# Altium schematic sheet stm8.SchDoc
size A3
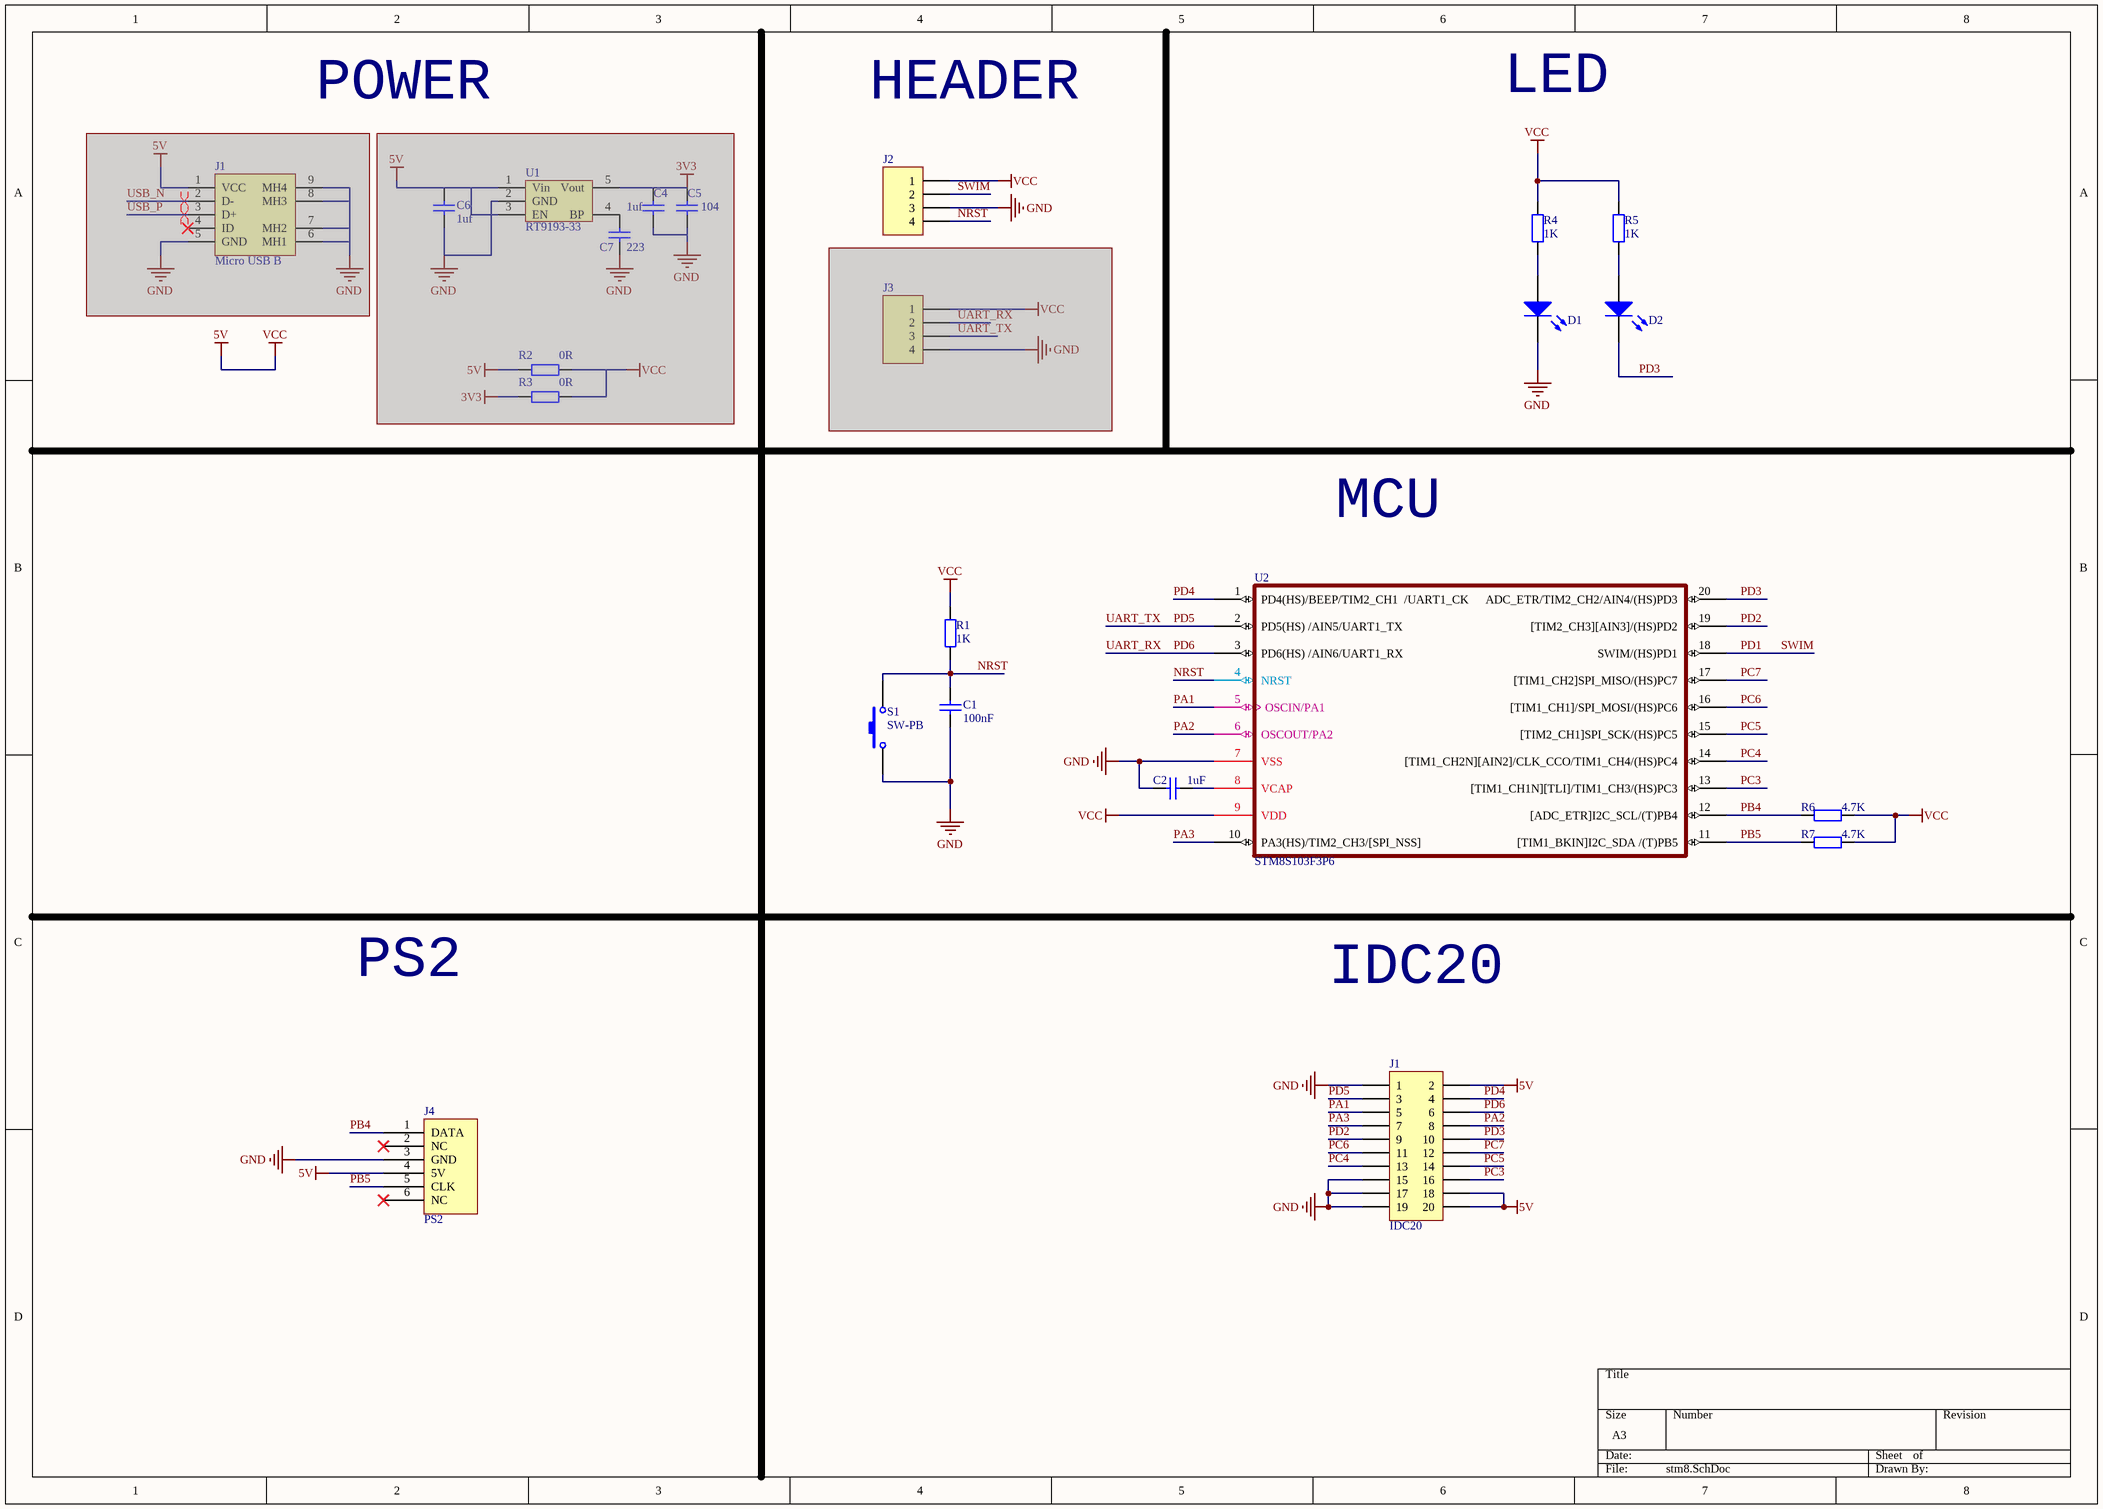
[diagram p0: stm8.SchDoc]

## Parts
(Parts that share a designator on the sheet are numbered #1, #2 ... from top to bottom, then left to right.)
C1  value 100nF  [0603_C]  (hidden comment: Cap)
C2  value 1uF  [0603_C]  (hidden comment: Cap)
C4  1uf  [0603_C]  (masked out: inside a compile mask, not in the netlist)
C5  104  [0603_C]  (masked out: inside a compile mask, not in the netlist)
C6  1uf  [0603_C]  (masked out: inside a compile mask, not in the netlist)
C7  223  [0603_C]  (masked out: inside a compile mask, not in the netlist)
D1  LED0  [0603_LED]  (value not drawn)
D2  LED0  [0603_LED]  (value not drawn)
J1#1  Micro USB B  [USB_MICRO_5S_B]  (masked out: inside a compile mask, not in the netlist)
J1#2  IDC20  [IDC20]
J2  Header 4  [HEADER_4x1]  (value not drawn)
J3  Header 4  [HEADER_4x1]  (value not drawn)  (masked out: inside a compile mask, not in the netlist)
J4  PS2  [PS2]
R1  value 1K  [0603_R]  (hidden comment: Res2)
R2  value 0R  [0603_R]  (hidden comment: Res2)  (masked out: inside a compile mask, not in the netlist)
R3  value 0R  [0603_R]  (hidden comment: Res2)  (masked out: inside a compile mask, not in the netlist)
R4  value 1K  [0603_R]  (hidden comment: Res2)
R5  value 1K  [0603_R]  (hidden comment: Res2)
R6  value 4.7K  [0603_R]  (hidden comment: Res2)
R7  value 4.7K  [0603_R]  (hidden comment: Res2)
S1  SW-PB  [TSW DIP-6*6*6]
U1  RT9193-33  [SOT23-5]  (masked out: inside a compile mask, not in the netlist)
U2  STM8S103F3P6  [TSSOP20]

## Nets
5V: J1#2.2 J1#2.18 J1#2.20 J2.1 J4.4(5V) R1.1 R4.1 R5.1 R6.2 R7.2 U2.9(VDD)  [also labelled VCC]
GND: C1.1 C2.1 D1.2(K) J1#2.1 J1#2.15 J1#2.17 J1#2.19 J2.3 J4.3(GND) S1.1 U2.7(VSS)
NRST: C1.2 J2.4 R1.2 S1.2 U2.4(NRST)
PA1: J1#2.5 U2.5(OSCIN/PA1)
PA2: J1#2.8 U2.6(OSCOUT/PA2)
PA3: J1#2.7 U2.10(PA3(HS)/TIM2_CH3/[SPI_NSS])
PB4: J4.1(DATA) R6.1 U2.12([ADC_ETR]I2C_SCL/(T)PB4)
PB5: J4.5(CLK) R7.1 U2.11([TIM1_BKIN]I2C_SDA_/(T)PB5)
PC3: J1#2.16 U2.13([TIM1_CH1N][TLI]/TIM1_CH3/(HS)PC3)
PC4: J1#2.13 U2.14([TIM1_CH2N][AIN2]/CLK_CCO/TIM1_CH4/(HS)PC4)
PC5: J1#2.14 U2.15([TIM2_CH1]SPI_SCK/(HS)PC5)
PC6: J1#2.11 U2.16([TIM1_CH1]/SPI_MOSI/(HS)PC6)
PC7: J1#2.12 U2.17([TIM1_CH2]SPI_MISO/(HS)PC7)
PD1: J2.2 U2.18(SWIM/(HS)PD1)  [also labelled SWIM]
PD2: J1#2.9 U2.19([TIM2_CH3][AIN3]/(HS)PD2)
PD3: D2.2(K) J1#2.10 U2.20(ADC_ETR/TIM2_CH2/AIN4/(HS)PD3)
PD4: J1#2.4 U2.1(PD4(HS)/BEEP/TIM2_CH1__/UART1_CK)
PD5: J1#2.3 U2.2(PD5(HS)_/AIN5/UART1_TX)  [also labelled UART_TX]
PD6: J1#2.6 U2.3(PD6(HS)_/AIN6/UART1_RX)  [also labelled UART_RX]
NetC2_2: C2.2 U2.8(VCAP)
NetD1_1: D1.1(A) R4.2
NetD2_1: D2.1(A) R5.2

Not connected (* = marked no-connect by the designer): J4 2(NC)* 6(NC)*

## Layout directives
differential pair: (no net found under the mark)

## Notes on the sheet
- POWER
- HEADER
- LED
- MCU
- PS2
- IDC20

## Library data of the parts
C1 C2 = Cap: Capacitor; Published: 8-Jun-2000; LatestRevisionDate: 17-Jul-2002; LatestRevisionNote: Re-released for DXP Platform.; PackageReference: RAD-0.3; Publisher: Altium Limited; PackageDescription: Radial Cap, Thru-Hole; 2 Leads; 0.3 in Pin Spacing
C4 C6 C7 = CAP: Capacitor
  C4 C6: value: 1uF
  C7: value: 223
C5 = CAP: Capacitor; value: 0.1uF
D1 D2 = LED0: Typical INFRARED GaAs LED; Published: 8-Jun-2000; LatestRevisionDate: 08-Jul-2005; LatestRevisionNote: Mech Layer 1 removed.; PackageReference: LED-0; Publisher: Altium Limited; PackageDescription: LED; 2 Leads
J2 J3 = Header 4: Header, 4-Pin; LatestRevisionDate: 17-Jul-2002; LatestRevisionNote: Re-released for DXP Platform.; Publisher: Altium Limited
R1-R7 = Res2: Resistor; Published: 8-Jun-2000; LatestRevisionDate: 17-Jul-2002; LatestRevisionNote: Re-released for DXP Platform.; PackageReference: AXIAL-0.4; Publisher: Altium Limited; PackageDescription: Axial Device, Thru-Hole; 2 Leads; 0.4 in Pin Spacing
S1 = SW-PB: Switch; Published: 24-Mar-1999; LatestRevisionDate: 17-Jul-2002; LatestRevisionNote: Re-released for DXP Platform.; PackageReference: SPST-2; Publisher: Altium Limited; PackageDescription: Switch; 2 Leads
U2 = STM8S103F3P6: ST 8-bit  Microcontroller